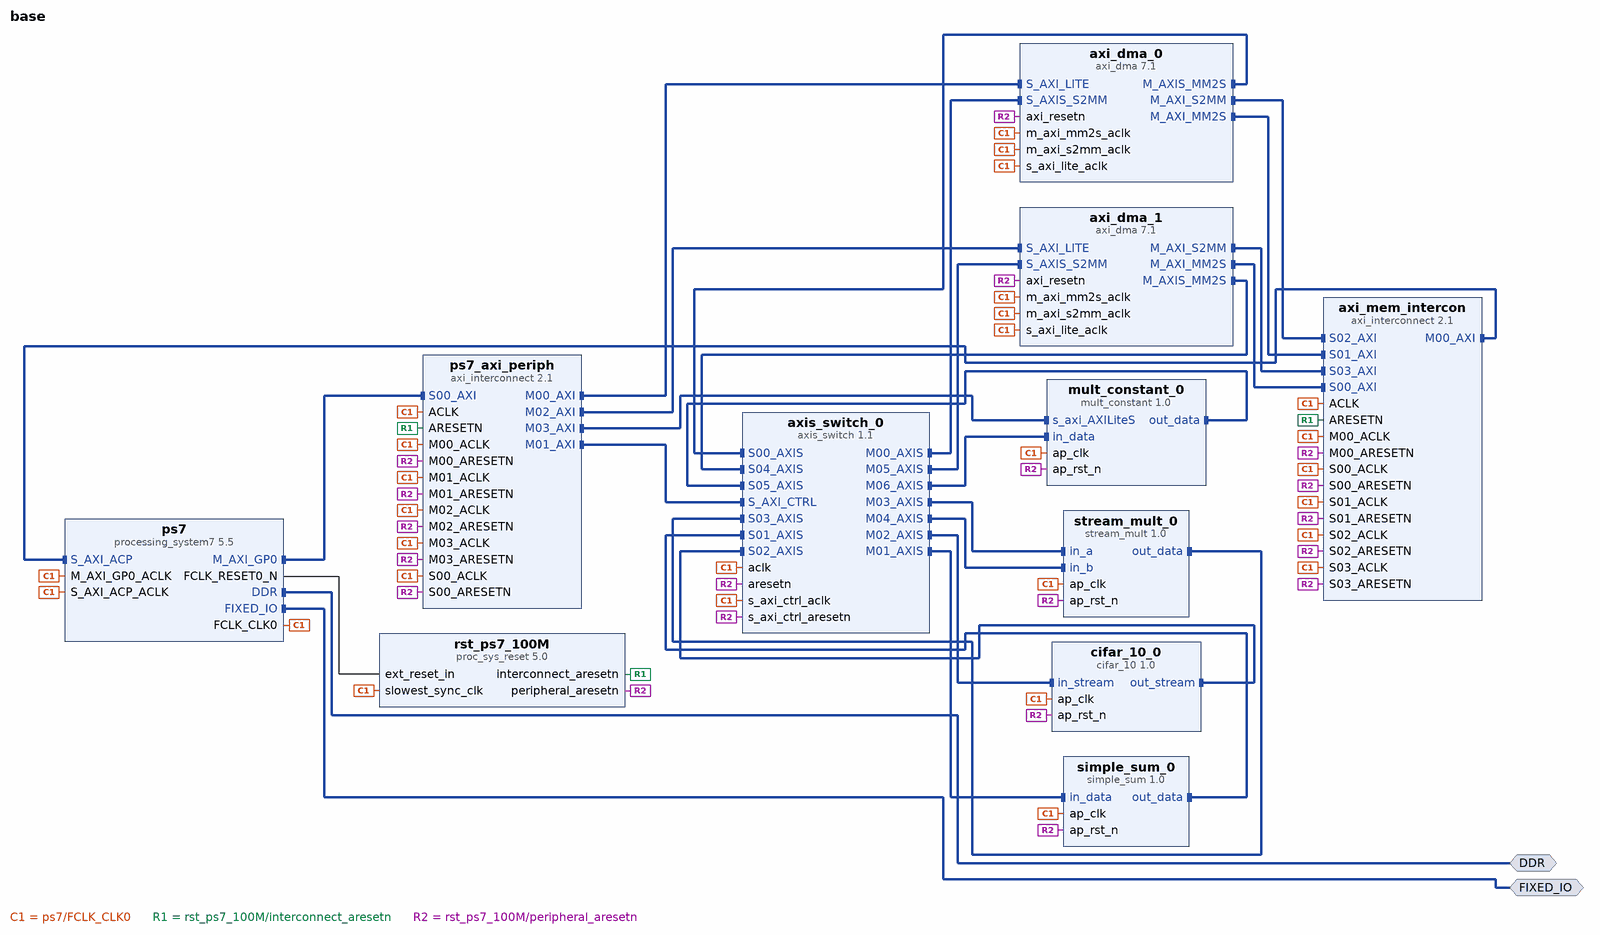
[diagram p0: block diagram of the top level]
# Vivado block design base, xc7z020clg484-1, Vivado 2019.1
create_bd_design base

create_bd_intf_port -mode Master -vlnv xilinx.com:interface:ddrx_rtl:1.0 DDR
create_bd_intf_port -mode Master -vlnv xilinx.com:display_processing_system7:fixedio_rtl:1.0 FIXED_IO

create_bd_cell -type ip -vlnv xilinx.com:ip:axi_dma:7.1 axi_dma_0
set_property -dict {CONFIG.c_include_sg 0 CONFIG.c_sg_length_width 23} [get_bd_cells axi_dma_0]
create_bd_cell -type ip -vlnv xilinx.com:ip:axi_dma:7.1 axi_dma_1
set_property -dict {CONFIG.c_include_sg 0 CONFIG.c_sg_length_width 23} [get_bd_cells axi_dma_1]
create_bd_cell -type ip -vlnv xilinx.com:ip:axi_interconnect:2.1 axi_mem_intercon
set_property -dict {CONFIG.NUM_MI 1 CONFIG.NUM_SI 4} [get_bd_cells axi_mem_intercon]
create_bd_cell -type ip -vlnv xilinx.com:ip:axis_switch:1.1 axis_switch_0
set_property -dict [list \
  CONFIG.DECODER_REG 1 \
  CONFIG.NUM_MI 7 \
  CONFIG.NUM_SI 6 \
  CONFIG.OUTPUT_REG 1 \
  CONFIG.ROUTING_MODE 1 \
] [get_bd_cells axis_switch_0]
create_bd_cell -type ip -vlnv xilinx.com:ip:axi_interconnect:2.1 ps7_axi_periph
set_property -dict {CONFIG.NUM_MI 4} [get_bd_cells ps7_axi_periph]
create_bd_cell -type ip -vlnv Xilinx:hls:simple_sum:1.0 simple_sum_0
create_bd_cell -type ip -vlnv Xilinx:hls:stream_mult:1.0 stream_mult_0
create_bd_cell -type ip -vlnv Xilinx:hls:mult_constant:1.0 mult_constant_0
create_bd_cell -type ip -vlnv xilinx.com:hls:cifar_10:1.0 cifar_10_0
create_bd_cell -type ip -vlnv xilinx.com:ip:processing_system7:5.5 ps7
set_property -dict [list \
  CONFIG.PCW_APU_PERIPHERAL_FREQMHZ 650 \
  CONFIG.PCW_CRYSTAL_PERIPHERAL_FREQMHZ 50 \
  CONFIG.PCW_ENET0_ENET0_IO {MIO 16 .. 27} \
  CONFIG.PCW_ENET0_GRP_MDIO_ENABLE 1 \
  CONFIG.PCW_ENET0_GRP_MDIO_IO {MIO 52 .. 53} \
  CONFIG.PCW_ENET0_PERIPHERAL_ENABLE 1 \
  CONFIG.PCW_ENET0_RESET_ENABLE 1 \
  CONFIG.PCW_ENET0_RESET_IO {MIO 9} \
  CONFIG.PCW_ENET_RESET_ENABLE 1 \
  CONFIG.PCW_ENET_RESET_SELECT {Share reset pin} \
  CONFIG.PCW_FPGA0_PERIPHERAL_FREQMHZ 100 \
  CONFIG.PCW_FPGA1_PERIPHERAL_FREQMHZ 50 \
  CONFIG.PCW_GPIO_MIO_GPIO_ENABLE 1 \
  CONFIG.PCW_GPIO_MIO_GPIO_IO MIO \
  CONFIG.PCW_I2C_RESET_ENABLE 1 \
  CONFIG.PCW_M_AXI_GP0_FREQMHZ 10 \
  CONFIG.PCW_PERIPHERAL_BOARD_PRESET part0 \
  CONFIG.PCW_PRESET_BANK1_VOLTAGE {LVCMOS 1.8V} \
  CONFIG.PCW_QSPI_GRP_FBCLK_ENABLE 1 \
  CONFIG.PCW_QSPI_GRP_FBCLK_IO {MIO 8} \
  CONFIG.PCW_QSPI_GRP_SINGLE_SS_ENABLE 1 \
  CONFIG.PCW_QSPI_GRP_SINGLE_SS_IO {MIO 1 .. 6} \
  CONFIG.PCW_QSPI_PERIPHERAL_ENABLE 1 \
  CONFIG.PCW_QSPI_QSPI_IO {MIO 1 .. 6} \
  CONFIG.PCW_SD0_GRP_CD_ENABLE 1 \
  CONFIG.PCW_SD0_GRP_CD_IO {MIO 47} \
  CONFIG.PCW_SD0_GRP_WP_ENABLE 0 \
  CONFIG.PCW_SD0_PERIPHERAL_ENABLE 1 \
  CONFIG.PCW_SD0_SD0_IO {MIO 40 .. 45} \
  CONFIG.PCW_SDIO_PERIPHERAL_FREQMHZ 50 \
  CONFIG.PCW_SINGLE_QSPI_DATA_MODE x4 \
  CONFIG.PCW_UART0_PERIPHERAL_ENABLE 1 \
  CONFIG.PCW_UART0_UART0_IO {MIO 14 .. 15} \
  CONFIG.PCW_UART1_PERIPHERAL_ENABLE 0 \
  CONFIG.PCW_UART_PERIPHERAL_FREQMHZ 100 \
  CONFIG.PCW_UIPARAM_DDR_BUS_WIDTH {16 Bit} \
  CONFIG.PCW_UIPARAM_DDR_FREQ_MHZ 525 \
  CONFIG.PCW_UIPARAM_DDR_PARTNO {MT41J256M16 RE-125} \
  CONFIG.PCW_USB0_PERIPHERAL_ENABLE 1 \
  CONFIG.PCW_USB0_RESET_ENABLE 1 \
  CONFIG.PCW_USB0_RESET_IO {MIO 46} \
  CONFIG.PCW_USB0_USB0_IO {MIO 28 .. 39} \
  CONFIG.PCW_USB_RESET_ENABLE 1 \
  CONFIG.PCW_USB_RESET_SELECT {Share reset pin} \
  CONFIG.PCW_USE_DEFAULT_ACP_USER_VAL 1 \
  CONFIG.PCW_USE_S_AXI_ACP 1 \
] [get_bd_cells ps7]
# 500 more settings of ps7 are not shown: defaults, MIO pin electricals, DDR timing, and values the tool derives
create_bd_cell -type ip -vlnv xilinx.com:ip:proc_sys_reset:5.0 rst_ps7_100M

# ---- connections ----

connect_bd_intf_net [get_bd_intf_pins axi_dma_1/S_AXI_LITE] [get_bd_intf_pins ps7_axi_periph/M02_AXI]
connect_bd_intf_net [get_bd_intf_pins mult_constant_0/out_data] [get_bd_intf_pins axis_switch_0/S05_AXIS]
connect_bd_intf_net [get_bd_intf_pins mult_constant_0/s_axi_AXILiteS] [get_bd_intf_pins ps7_axi_periph/M03_AXI]
connect_bd_intf_net [get_bd_intf_pins stream_mult_0/in_a] [get_bd_intf_pins axis_switch_0/M03_AXIS]
connect_bd_intf_net [get_bd_intf_pins simple_sum_0/in_data] [get_bd_intf_pins axis_switch_0/M01_AXIS]
connect_bd_intf_net [get_bd_intf_pins simple_sum_0/out_data] [get_bd_intf_pins axis_switch_0/S01_AXIS]
connect_bd_intf_net [get_bd_intf_pins stream_mult_0/out_data] [get_bd_intf_pins axis_switch_0/S03_AXIS]
connect_bd_intf_net [get_bd_intf_pins stream_mult_0/in_b] [get_bd_intf_pins axis_switch_0/M04_AXIS]
connect_bd_intf_net [get_bd_intf_pins axi_mem_intercon/M00_AXI] [get_bd_intf_pins ps7/S_AXI_ACP]
connect_bd_intf_net [get_bd_intf_pins axi_dma_0/S_AXIS_S2MM] [get_bd_intf_pins axis_switch_0/M00_AXIS]
connect_bd_intf_net [get_bd_intf_pins ps7/M_AXI_GP0] [get_bd_intf_pins ps7_axi_periph/S00_AXI]
connect_bd_intf_net [get_bd_intf_pins axi_dma_1/S_AXIS_S2MM] [get_bd_intf_pins axis_switch_0/M05_AXIS]
connect_bd_intf_net [get_bd_intf_pins axi_dma_0/S_AXI_LITE] [get_bd_intf_pins ps7_axi_periph/M00_AXI]
connect_bd_intf_net [get_bd_intf_pins axis_switch_0/S_AXI_CTRL] [get_bd_intf_pins ps7_axi_periph/M01_AXI]
connect_bd_intf_net [get_bd_intf_pins mult_constant_0/in_data] [get_bd_intf_pins axis_switch_0/M06_AXIS]
connect_bd_intf_net [get_bd_intf_pins cifar_10_0/out_stream] [get_bd_intf_pins axis_switch_0/S02_AXIS]
connect_bd_intf_net [get_bd_intf_pins cifar_10_0/in_stream] [get_bd_intf_pins axis_switch_0/M02_AXIS]
connect_bd_intf_net -intf_net processing_system7_0_DDR [get_bd_intf_ports DDR] [get_bd_intf_pins ps7/DDR]
connect_bd_intf_net -intf_net processing_system7_0_FIXED_IO [get_bd_intf_ports FIXED_IO] [get_bd_intf_pins ps7/FIXED_IO]
connect_bd_intf_net [get_bd_intf_pins axi_dma_0/M_AXI_S2MM] [get_bd_intf_pins axi_mem_intercon/S02_AXI]
connect_bd_intf_net [get_bd_intf_pins axi_dma_0/M_AXIS_MM2S] [get_bd_intf_pins axis_switch_0/S00_AXIS]
connect_bd_intf_net [get_bd_intf_pins axi_dma_0/M_AXI_MM2S] [get_bd_intf_pins axi_mem_intercon/S01_AXI]
connect_bd_intf_net [get_bd_intf_pins axi_dma_1/M_AXI_S2MM] [get_bd_intf_pins axi_mem_intercon/S03_AXI]
connect_bd_intf_net [get_bd_intf_pins axi_dma_1/M_AXI_MM2S] [get_bd_intf_pins axi_mem_intercon/S00_AXI]
connect_bd_intf_net [get_bd_intf_pins axi_dma_1/M_AXIS_MM2S] [get_bd_intf_pins axis_switch_0/S04_AXIS]
connect_bd_net [get_bd_pins ps7/FCLK_CLK0] \
  [get_bd_pins axi_dma_0/m_axi_mm2s_aclk] [get_bd_pins axi_dma_0/m_axi_s2mm_aclk] [get_bd_pins axi_dma_0/s_axi_lite_aclk] \
  [get_bd_pins axi_dma_1/m_axi_mm2s_aclk] [get_bd_pins axi_dma_1/m_axi_s2mm_aclk] [get_bd_pins axi_dma_1/s_axi_lite_aclk] \
  [get_bd_pins axis_switch_0/aclk] [get_bd_pins axis_switch_0/s_axi_ctrl_aclk] [get_bd_pins simple_sum_0/ap_clk] \
  [get_bd_pins stream_mult_0/ap_clk] [get_bd_pins mult_constant_0/ap_clk] [get_bd_pins cifar_10_0/ap_clk] \
  [get_bd_pins axi_mem_intercon/ACLK] [get_bd_pins axi_mem_intercon/M00_ACLK] [get_bd_pins axi_mem_intercon/S00_ACLK] \
  [get_bd_pins axi_mem_intercon/S01_ACLK] [get_bd_pins axi_mem_intercon/S02_ACLK] [get_bd_pins axi_mem_intercon/S03_ACLK] \
  [get_bd_pins ps7_axi_periph/ACLK] [get_bd_pins ps7_axi_periph/M00_ACLK] [get_bd_pins ps7_axi_periph/M01_ACLK] \
  [get_bd_pins ps7_axi_periph/M02_ACLK] [get_bd_pins ps7_axi_periph/M03_ACLK] [get_bd_pins ps7_axi_periph/S00_ACLK] \
  [get_bd_pins ps7/M_AXI_GP0_ACLK] [get_bd_pins ps7/S_AXI_ACP_ACLK] [get_bd_pins rst_ps7_100M/slowest_sync_clk]
connect_bd_net [get_bd_pins ps7/FCLK_RESET0_N] [get_bd_pins rst_ps7_100M/ext_reset_in]
connect_bd_net [get_bd_pins rst_ps7_100M/interconnect_aresetn] [get_bd_pins axi_mem_intercon/ARESETN] [get_bd_pins ps7_axi_periph/ARESETN]
connect_bd_net [get_bd_pins rst_ps7_100M/peripheral_aresetn] \
  [get_bd_pins axi_dma_0/axi_resetn] [get_bd_pins axi_dma_1/axi_resetn] [get_bd_pins axis_switch_0/aresetn] \
  [get_bd_pins axis_switch_0/s_axi_ctrl_aresetn] [get_bd_pins simple_sum_0/ap_rst_n] [get_bd_pins stream_mult_0/ap_rst_n] \
  [get_bd_pins mult_constant_0/ap_rst_n] [get_bd_pins cifar_10_0/ap_rst_n] [get_bd_pins axi_mem_intercon/M00_ARESETN] \
  [get_bd_pins axi_mem_intercon/S00_ARESETN] [get_bd_pins axi_mem_intercon/S01_ARESETN] \
  [get_bd_pins axi_mem_intercon/S02_ARESETN] [get_bd_pins axi_mem_intercon/S03_ARESETN] \
  [get_bd_pins ps7_axi_periph/M00_ARESETN] [get_bd_pins ps7_axi_periph/M01_ARESETN] [get_bd_pins ps7_axi_periph/M02_ARESETN] \
  [get_bd_pins ps7_axi_periph/M03_ARESETN] [get_bd_pins ps7_axi_periph/S00_ARESETN]

# ---- address map ----
assign_bd_address -offset 0x00000000 -range 512M -target_address_space [get_bd_addr_spaces axi_dma_0/Data_MM2S] [get_bd_addr_segs ps7/S_AXI_ACP/ACP_DDR_LOWOCM]
assign_bd_address -offset 0xFC000000 -range 16M -target_address_space [get_bd_addr_spaces axi_dma_0/Data_MM2S] [get_bd_addr_segs ps7/S_AXI_ACP/ACP_QSPI_LINEAR]
exclude_bd_addr_seg -offset 0x40000000 -range 1G -target_address_space [get_bd_addr_spaces axi_dma_0/Data_MM2S] [get_bd_addr_segs ps7/S_AXI_ACP/ACP_M_AXI_GP0]
exclude_bd_addr_seg -offset 0xE0000000 -range 4M -target_address_space [get_bd_addr_spaces axi_dma_0/Data_MM2S] [get_bd_addr_segs ps7/S_AXI_ACP/ACP_IOP]
assign_bd_address -offset 0x00000000 -range 512M -target_address_space [get_bd_addr_spaces axi_dma_0/Data_S2MM] [get_bd_addr_segs ps7/S_AXI_ACP/ACP_DDR_LOWOCM]
assign_bd_address -offset 0xFC000000 -range 16M -target_address_space [get_bd_addr_spaces axi_dma_0/Data_S2MM] [get_bd_addr_segs ps7/S_AXI_ACP/ACP_QSPI_LINEAR]
exclude_bd_addr_seg -offset 0x40000000 -range 1G -target_address_space [get_bd_addr_spaces axi_dma_0/Data_S2MM] [get_bd_addr_segs ps7/S_AXI_ACP/ACP_M_AXI_GP0]
exclude_bd_addr_seg -offset 0xE0000000 -range 4M -target_address_space [get_bd_addr_spaces axi_dma_0/Data_S2MM] [get_bd_addr_segs ps7/S_AXI_ACP/ACP_IOP]
assign_bd_address -offset 0x00000000 -range 512M -target_address_space [get_bd_addr_spaces axi_dma_1/Data_MM2S] [get_bd_addr_segs ps7/S_AXI_ACP/ACP_DDR_LOWOCM]
assign_bd_address -offset 0xFC000000 -range 16M -target_address_space [get_bd_addr_spaces axi_dma_1/Data_MM2S] [get_bd_addr_segs ps7/S_AXI_ACP/ACP_QSPI_LINEAR]
exclude_bd_addr_seg -offset 0x40000000 -range 1G -target_address_space [get_bd_addr_spaces axi_dma_1/Data_MM2S] [get_bd_addr_segs ps7/S_AXI_ACP/ACP_M_AXI_GP0]
exclude_bd_addr_seg -offset 0xE0000000 -range 4M -target_address_space [get_bd_addr_spaces axi_dma_1/Data_MM2S] [get_bd_addr_segs ps7/S_AXI_ACP/ACP_IOP]
assign_bd_address -offset 0x00000000 -range 512M -target_address_space [get_bd_addr_spaces axi_dma_1/Data_S2MM] [get_bd_addr_segs ps7/S_AXI_ACP/ACP_DDR_LOWOCM]
assign_bd_address -offset 0xFC000000 -range 16M -target_address_space [get_bd_addr_spaces axi_dma_1/Data_S2MM] [get_bd_addr_segs ps7/S_AXI_ACP/ACP_QSPI_LINEAR]
exclude_bd_addr_seg -offset 0x40000000 -range 1G -target_address_space [get_bd_addr_spaces axi_dma_1/Data_S2MM] [get_bd_addr_segs ps7/S_AXI_ACP/ACP_M_AXI_GP0]
exclude_bd_addr_seg -offset 0xE0000000 -range 4M -target_address_space [get_bd_addr_spaces axi_dma_1/Data_S2MM] [get_bd_addr_segs ps7/S_AXI_ACP/ACP_IOP]
assign_bd_address -offset 0x40400000 -range 64K -target_address_space [get_bd_addr_spaces ps7/Data] [get_bd_addr_segs axi_dma_0/S_AXI_LITE/Reg]
assign_bd_address -offset 0x40410000 -range 64K -target_address_space [get_bd_addr_spaces ps7/Data] [get_bd_addr_segs axi_dma_1/S_AXI_LITE/Reg]
assign_bd_address -offset 0x43C00000 -range 64K -target_address_space [get_bd_addr_spaces ps7/Data] [get_bd_addr_segs axis_switch_0/S_AXI_CTRL/Reg]

validate_bd_design
save_bd_design
